# Altium schematic sheet HIGHSPEED_v0_SF2-POWER.SchDoc
size A3
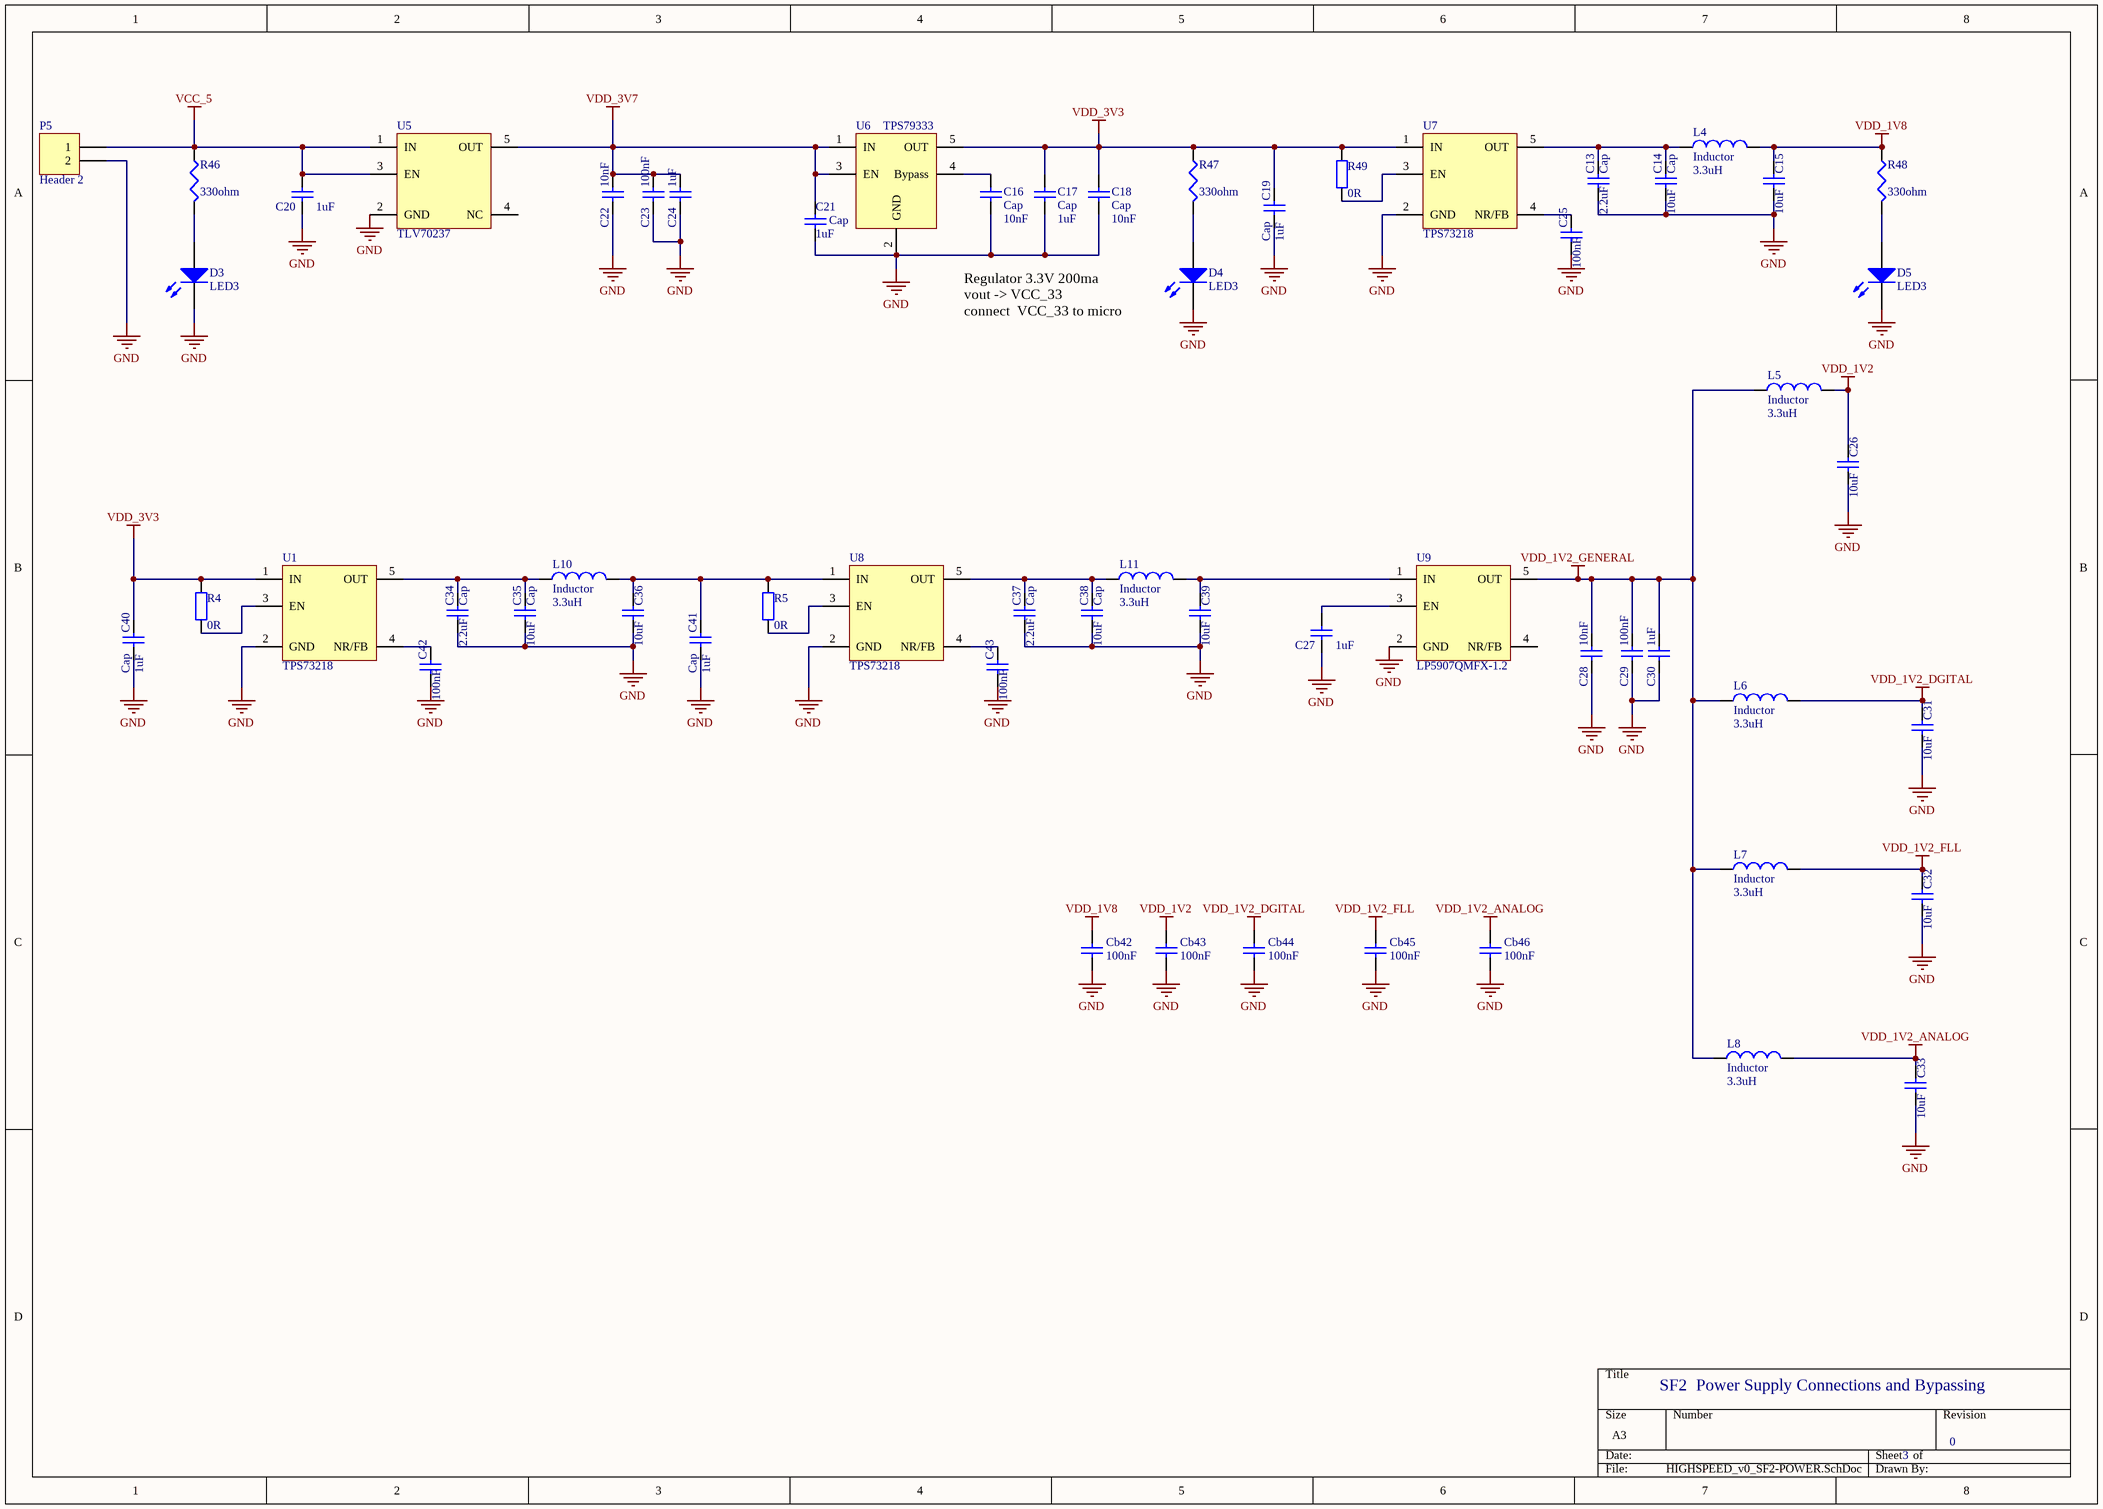
[diagram p0: HIGHSPEED_v0_SF2-POWER.SchDoc]

## Parts
C13  Cap  value 2.2uF  [0603]
C14  Cap  value 10uF  [0603]
C15  value 10uF  [0603]  (hidden comment: Cap)
C16  Cap  value 10nF  [cap_0402_R - modified]
C17  Cap  value 1uF  [cap_0402_R - modified]
C18  Cap  value 10nF  [cap_0402_R - modified]
C19  Cap  value 1uF  [0603]
C20  value 1uF  [1608[0603]]  (hidden comment: Cap Semi)
C21  Cap  value 1uF  [cap_0402_R - modified]
C22  value 10nF  [1608[0603]]  (hidden comment: Cap Semi)
C23  value 100nF  [1608[0603]]  (hidden comment: Cap Semi)
C24  value 1uF  [1608[0603]]  (hidden comment: Cap Semi)
C25  value 100nF  [0603]
C26  value 10uF  [0603]  (hidden comment: Cap)
C27  value 1uF  [1608[0603]]  (hidden comment: Cap Semi)
C28  value 10nF  [1608[0603]]  (hidden comment: Cap Semi)
C29  value 100nF  [1608[0603]]  (hidden comment: Cap Semi)
C30  value 1uF  [1608[0603]]  (hidden comment: Cap Semi)
C31  value 10uF  [0603]  (hidden comment: Cap)
C32  value 10uF  [0603]  (hidden comment: Cap)
C33  value 10uF  [0603]  (hidden comment: Cap)
C34  Cap  value 2.2uF  [0603]
C35  Cap  value 10uF  [0603]
C36  value 10uF  [0603]  (hidden comment: Cap)
C37  Cap  value 2.2uF  [0603]
C38  Cap  value 10uF  [0603]
C39  value 10uF  [0603]  (hidden comment: Cap)
C40  Cap  value 1uF  [0603]
C41  Cap  value 1uF  [0603]
C42  value 100nF  [0603]
C43  value 100nF  [0603]
Cb42  value 100nF  [c0603-Murata-GR]  (hidden comment: GRM187R61A226ME15D)
Cb43  value 100nF  [c0603-Murata-GR]  (hidden comment: GRM187R61A226ME15D)
Cb44  value 100nF  [c0603-Murata-GR]  (hidden comment: GRM187R61A226ME15D)
Cb45  value 100nF  [c0603-Murata-GR]  (hidden comment: GRM187R61A226ME15D)
Cb46  value 100nF  [c0603-Murata-GR]  (hidden comment: GRM187R61A226ME15D)
D3  LED3  [0603]
D4  LED3  [0603]
D5  LED3  [0603]
L4  Inductor  value 3.3uH  [1608[0603]]
L5  Inductor  value 3.3uH  [1608[0603]]
L6  Inductor  value 3.3uH  [1608[0603]]
L7  Inductor  value 3.3uH  [1608[0603]]
L8  Inductor  value 3.3uH  [1608[0603]]
L10  Inductor  value 3.3uH  [1608[0603]]
L11  Inductor  value 3.3uH  [1608[0603]]
P5  Header 2  [HDR1X2]
R4  value 0R  [0603]
R5  value 0R  [0603]
R46  value 330ohm  [res_0402_R - modified]  (hidden comment: Res3)
R47  value 330ohm  [res_0402_R - modified]  (hidden comment: Res3)
R48  value 330ohm  [res_0402_R - modified]  (hidden comment: Res3)
R49  value 0R  [0603]
U1  TPS73218  [SOT23__DDC__(R - PDSO-  G5)]
U5  TLV70237  [SOT23__DDC__(R - PDSO-  G5)]
U6  TPS79333  [SOT_23__DBV_(R - PDSO - G5)]
U7  TPS73218  [SOT23__DDC__(R - PDSO-  G5)]
U8  TPS73218  [SOT23__DDC__(R - PDSO-  G5)]
U9  LP5907QMFX-1.2  [SOT23__DDC__(R - PDSO-  G5)]

## Nets
GND: C13.2 C14.2 C15.2 C16.1 C17.2 C18.1 C19.2 C20.1 C21.1 C22.1 C23.1 C24.1 C25.2 C26.2 C27.1 C28.1 C29.1 C30.1 C31.2 C32.2 C33.2 C34.2 C35.2 C36.2 C37.2 C38.2 C39.2 C40.2 C41.2 C42.2 C43.2 Cb42.1 Cb43.1 Cb44.1 Cb45.1 Cb46.1 D3.2(K) D4.2(K) D5.2(K) P5.2 U1.2(GND) U5.2(GND) U6.2(GND) U7.2(GND) U8.2(GND) U9.2(GND)
VCC_5: C20.2 P5.1 R46.1 U5.1(IN) U5.3(EN)
VDD_1V2: C26.1 Cb43.2 L5.2
VDD_1V2_ANALOG: C33.1 Cb46.2 L8.2
VDD_1V2_DGITAL: C31.1 Cb44.2 L6.2
VDD_1V2_FLL: C32.1 Cb45.2 L7.2
VDD_1V2_GENERAL: C28.2 C29.2 C30.2 L5.1 L6.1 L7.1 L8.1 U9.5(OUT)
VDD_1V8: C15.1 Cb42.2 L4.2 R48.1
VDD_3V3: C17.1 C18.2 C19.1 C40.1 R4.2 R47.1 R49.2 U1.1(IN) U6.5(OUT) U7.1(IN)
VDD_3V7: C21.2 C22.2 C23.2 C24.2 U5.5(OUT) U6.1(IN) U6.3(EN)
NetC13_1: C13.1 C14.1 L4.1 U7.5(OUT)
NetC16_2: C16.2 U6.4(Bypass)
NetC25_1: C25.1 U7.4(NR/FB)
NetC27_2: C27.2 U9.3(EN)
NetC34_1: C34.1 C35.1 L10.1 U1.5(OUT)
NetC36_1: C36.1 C41.1 L10.2 R5.2 U8.1(IN)
NetC37_1: C37.1 C38.1 L11.1 U8.5(OUT)
NetC39_1: C39.1 L11.2 U9.1(IN)
NetC42_1: C42.1 U1.4(NR/FB)
NetC43_1: C43.1 U8.4(NR/FB)
NetD3_1: D3.1(A) R46.2
NetD4_1: D4.1(A) R47.2
NetD5_1: D5.1(A) R48.2
NetR4_1: R4.1 U1.3(EN)
NetR5_1: R5.1 U8.3(EN)
NetR49_1: R49.1 U7.3(EN)

Not connected (* = marked no-connect by the designer): U5 4(NC); U9 4(NR/FB)

## Notes on the sheet
- Regulator 3.3V 200ma
  vout -> VCC_33
  connect  VCC_33 to micro
- SF2  Power Supply Connections and Bypassing
- 3
- 0

## Library data of the parts
C13-C19 C21 C25 C26 C31-C43 = Cap: Capacitor; Published: 8-Jun-2000; LatestRevisionDate: 17-Jul-2002; LatestRevisionNote: Re-released for DXP Platform.; PackageReference: RAD-0.3; Publisher: Altium Limited; PackageDescription: Radial Cap, Thru-Hole; 2 Leads; 0.3 in Pin Spacing; MOUNT: M
C20 C22-C24 C27-C30 = Cap Semi: Capacitor; Published: 8-Jun-2000; LatestRevisionDate: 29-May-2009; LatestRevisionNote: IPC-7351 Footprint Added.; PackageReference: C1206; Publisher: Altium Limited; PackageDescription: Chip Capacitor; MOUNT: M
Cb42-Cb46 = Cap: CAP CER 22UF 10V X5R 0603; Manufacturer: Murata; Note: 10V X5R 20%; Supplier: Digikey; Supplier PN: 490-13243-1-ND; Manufacturer PN: GRM187R61A226ME15D
D3-D5 = LED3: Typical BLUE SiC LED; Published: 8-Jun-2000; LatestRevisionDate: 17-Dec-2003; LatestRevisionNote: PCB Footprint replaced.; DatasheetVersion: 16-Apr-2002; PackageVersion: 16-Apr-2002; PackageReference: 3.5X2.8X1.9; Publisher: Altium Limited; PackageDescription: SM LED; 2 C-Bend Leads; Body 3.5 x 2.8 x 1.9 mm, inc leads (LxWxH typ)
L4-L8 L10 L11 = Inductor: Code_IEC: 1005; Published: 8-Jun-2000; LatestRevisionDate: 29-May-2009; LatestRevisionNote: IPC-7351 Footprint Added.; PackageReference: 0402-A; Publisher: Altium Limited; PackageDescription: Chip Inductor; Code_JEITA: 0402; MOUNT: M
P5 = Header 2: Header, 2-Pin; LatestRevisionDate: 17-Jul-2002; LatestRevisionNote: Re-released for DXP Platform.; Publisher: Altium Limited
R4 R5 R49 = Res2: Resistor; Published: 8-Jun-2000; LatestRevisionDate: 17-Jul-2002; LatestRevisionNote: Re-released for DXP Platform.; PackageReference: AXIAL-0.4; Publisher: Altium Limited; PackageDescription: Axial Device, Thru-Hole; 2 Leads; 0.4 in Pin Spacing; MOUNT: M
R46-R48 = Res3: Resistor; Published: 8-Jun-2000; LatestRevisionDate: 29-May-2009; LatestRevisionNote: IPC-7351 Footprint Added.; PackageReference: J1-0603; Publisher: Altium Limited; PackageDescription: Chip Resistor
U1 U7 U8 = TPS73218: Linear Regulator
U5 = TLV70237: Linear Regulator; MOUNT: M
U6 = TPS79333: Regulator; MOUNT: M
U9 = LP5907QMFX-1.2: Linear Regulator